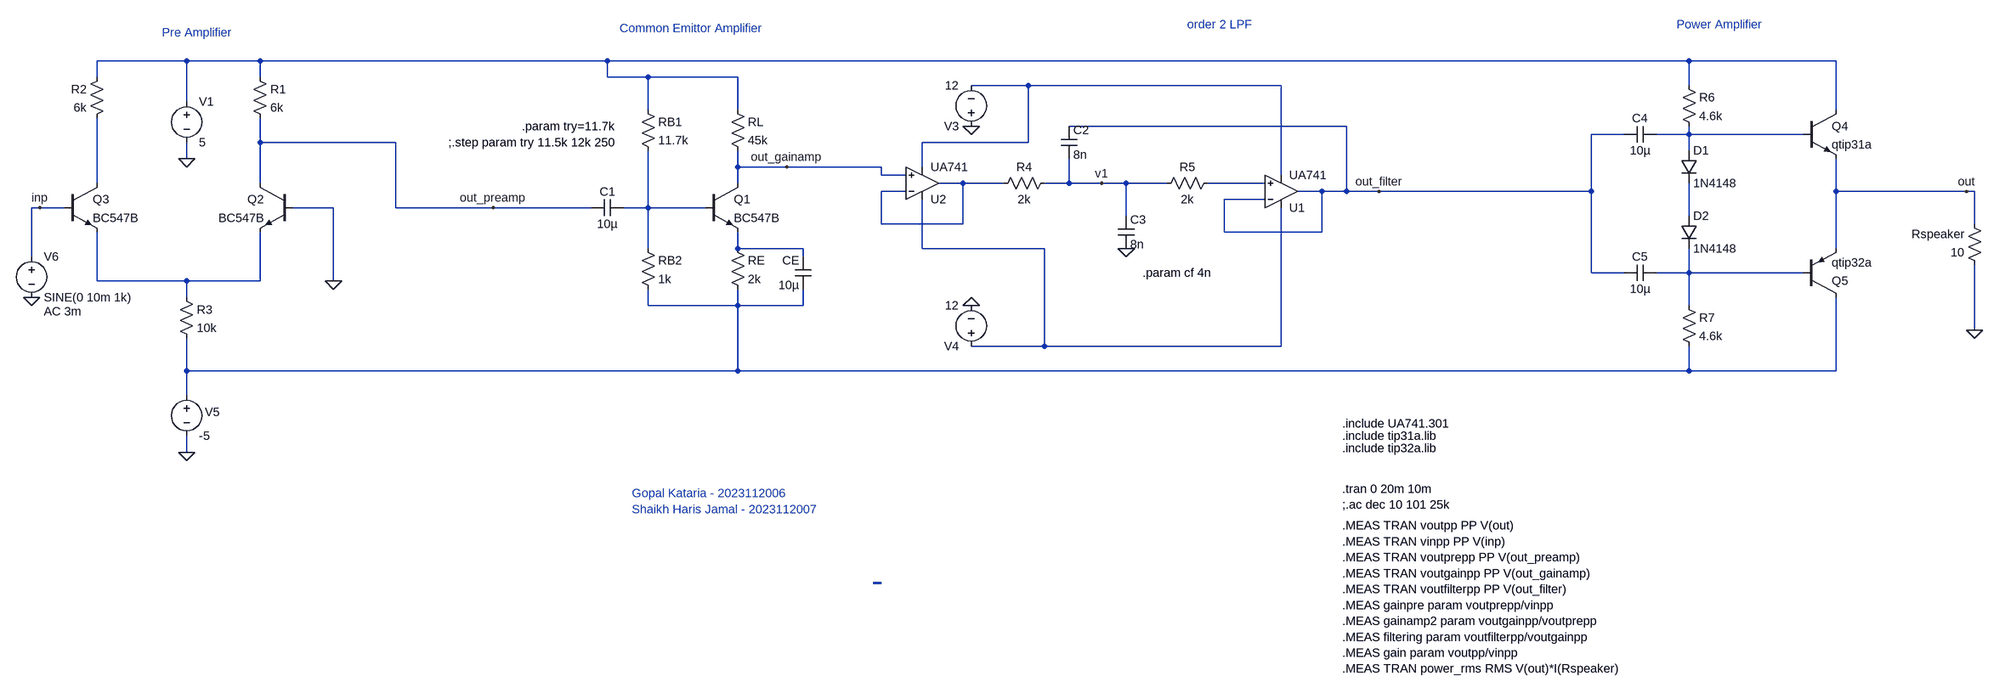
[diagram p0: schematic amplifier.asc]
amplifier.asc, the LTspice schematic file:
Version 4
SHEET 1 3276 1088
WIRE -1024 -176 -1200 -176
WIRE -880 -176 -1024 -176
WIRE -32 -176 -880 -176
WIRE 2288 -176 -32 -176
WIRE 2576 -176 2288 -176
WIRE -1200 -144 -1200 -176
WIRE -880 -144 -880 -176
WIRE -32 -144 -32 -176
WIRE 48 -144 -32 -144
WIRE 224 -144 48 -144
WIRE 992 -128 880 -128
WIRE 1488 -128 992 -128
WIRE 2288 -128 2288 -176
WIRE -1024 -96 -1024 -176
WIRE 48 -80 48 -144
WIRE 224 -80 224 -144
WIRE 2576 -80 2576 -176
WIRE 1616 -48 1072 -48
WIRE 2160 -32 2096 -32
WIRE 2288 -32 2288 -48
WIRE 2288 -32 2224 -32
WIRE 2512 -32 2288 -32
WIRE -880 -16 -880 -64
WIRE -464 -16 -880 -16
WIRE 992 -16 992 -128
WIRE 992 -16 784 -16
WIRE 2288 0 2288 -32
WIRE -1024 16 -1024 -16
WIRE 224 32 224 0
WIRE 320 32 224 32
WIRE 704 32 320 32
WIRE 784 32 784 -16
WIRE 704 48 704 32
WIRE 752 48 704 48
WIRE 1488 48 1488 -128
WIRE -1200 64 -1200 -64
WIRE -880 64 -880 -16
WIRE 224 64 224 32
WIRE 864 64 816 64
WIRE 944 64 864 64
WIRE 1072 64 1072 16
WIRE 1072 64 1024 64
WIRE 1136 64 1072 64
WIRE 1184 64 1136 64
WIRE 1264 64 1184 64
WIRE 1456 64 1344 64
WIRE 752 80 704 80
WIRE 1568 80 1520 80
WIRE 1616 80 1616 -48
WIRE 1616 80 1568 80
WIRE 1680 80 1616 80
WIRE 2064 80 1680 80
WIRE 2096 80 2096 -32
WIRE 2096 80 2064 80
WIRE 2576 80 2576 16
WIRE 2832 80 2576 80
WIRE 2848 80 2832 80
WIRE 1456 96 1376 96
WIRE -1312 112 -1328 112
WIRE -1264 112 -1312 112
WIRE -768 112 -816 112
WIRE -736 112 -768 112
WIRE -464 112 -464 -16
WIRE -256 112 -464 112
WIRE -64 112 -256 112
WIRE 48 112 48 0
WIRE 48 112 0 112
WIRE 160 112 48 112
WIRE 1184 128 1184 64
WIRE 2288 128 2288 64
WIRE 704 144 704 80
WIRE 864 144 864 64
WIRE 864 144 704 144
WIRE 2848 144 2848 80
WIRE 1376 160 1376 96
WIRE 1568 160 1568 80
WIRE 1568 160 1376 160
WIRE 48 192 48 112
WIRE 224 192 224 160
WIRE 352 192 224 192
WIRE 784 192 784 96
WIRE 1024 192 784 192
WIRE 2576 192 2576 80
WIRE -1328 208 -1328 112
WIRE 352 208 352 192
WIRE 2096 240 2096 80
WIRE 2160 240 2096 240
WIRE 2288 240 2288 192
WIRE 2288 240 2224 240
WIRE 2512 240 2288 240
WIRE -1200 256 -1200 160
WIRE -1024 256 -1200 256
WIRE -880 256 -880 160
WIRE -880 256 -1024 256
WIRE -736 256 -736 112
WIRE -1024 288 -1024 256
WIRE 48 304 48 272
WIRE 224 304 224 272
WIRE 224 304 48 304
WIRE 352 304 352 272
WIRE 352 304 224 304
WIRE 2288 304 2288 240
WIRE 2848 352 2848 224
WIRE 1024 384 1024 192
WIRE 1024 384 880 384
WIRE 1488 384 1488 112
WIRE 1488 384 1024 384
WIRE -1024 432 -1024 368
WIRE 224 432 224 304
WIRE 224 432 -1024 432
WIRE 2288 432 2288 384
WIRE 2288 432 224 432
WIRE 2576 432 2576 288
WIRE 2576 432 2288 432
WIRE -1024 480 -1024 432
WIRE -1024 592 -1024 560
FLAG -1024 16 0
FLAG -736 256 0
FLAG -1024 592 0
FLAG 1136 64 v1
FLAG 1184 192 0
FLAG 880 -48 0
FLAG 880 304 0
FLAG -1328 288 0
FLAG 2848 352 0
FLAG -1312 112 inp
FLAG -256 112 out_preamp
FLAG 320 32 out_gainamp
FLAG 1680 80 out_filter
FLAG 2832 80 out
DATAFLAG -768 112 ""
DATAFLAG 2064 80 ""
BUSTAP 688 848 704 848
SYMBOL npn 160 64 R0
SYMATTR InstName Q1
SYMATTR Value BC547B
SYMBOL cap 0 96 R90
WINDOW 0 0 32 VBottom 2
WINDOW 3 32 32 VTop 2
SYMATTR InstName C1
SYMATTR Value 10µ
SYMBOL res 32 -96 R0
SYMATTR InstName RB1
SYMATTR Value 11.7k
SYMBOL res 32 176 R0
SYMATTR InstName RB2
SYMATTR Value 1k
SYMBOL res 208 -96 R0
SYMATTR InstName RL
SYMATTR Value 45k
SYMBOL res 208 176 R0
SYMATTR InstName RE
SYMATTR Value 2k
SYMBOL cap 368 272 R180
WINDOW 0 24 56 Left 2
WINDOW 3 24 8 Left 2
SYMATTR InstName CE
SYMATTR Value 10µ
SYMBOL npn -816 64 M0
SYMATTR InstName Q2
SYMATTR Value BC547B
SYMBOL voltage -1024 -112 R0
WINDOW 123 0 0 Left 2
WINDOW 39 0 0 Left 2
SYMATTR InstName V1
SYMATTR Value 5
SYMBOL res -896 -160 R0
SYMATTR InstName R1
SYMATTR Value 6k
SYMBOL npn -1264 64 R0
SYMATTR InstName Q3
SYMATTR Value BC547B
SYMBOL res -1184 -160 M0
SYMATTR InstName R2
SYMATTR Value 6k
SYMBOL res -1040 272 R0
SYMATTR InstName R3
SYMATTR Value 10k
SYMBOL voltage -1024 464 R0
WINDOW 123 0 0 Left 2
WINDOW 39 0 0 Left 2
WINDOW 0 36 49 Left 2
SYMATTR InstName V5
SYMATTR Value -5
SYMBOL OpAmps\\opamp2 1488 144 M180
SYMATTR InstName U1
SYMATTR Value UA741
SYMBOL voltage 880 -32 R180
WINDOW 123 0 0 Left 2
WINDOW 39 0 0 Left 2
SYMATTR InstName V3
SYMATTR Value 12
SYMBOL voltage 880 400 R180
WINDOW 123 0 0 Left 2
WINDOW 39 0 0 Left 2
SYMATTR InstName V4
SYMATTR Value 12
SYMBOL res 1040 48 R90
WINDOW 0 0 56 VBottom 2
WINDOW 3 32 56 VTop 2
SYMATTR InstName R4
SYMATTR Value 2k
SYMBOL res 1360 48 R90
WINDOW 0 0 56 VBottom 2
WINDOW 3 32 56 VTop 2
SYMATTR InstName R5
SYMATTR Value 2k
SYMBOL cap 1056 -48 R0
SYMATTR InstName C2
SYMATTR Value 8n
SYMBOL cap 1168 128 R0
SYMATTR InstName C3
SYMATTR Value 8n
SYMBOL voltage -1328 192 R0
WINDOW 123 24 124 Left 2
WINDOW 39 0 0 Left 2
SYMATTR Value2 AC 3m
SYMATTR InstName V6
SYMATTR Value SINE(0 10m 1k)
SYMBOL OpAmps\\opamp2 784 128 M180
SYMATTR InstName U2
SYMATTR Value UA741
SYMBOL cap 2224 -48 R90
WINDOW 0 0 32 VBottom 2
WINDOW 3 32 32 VTop 2
SYMATTR InstName C4
SYMATTR Value 10µ
SYMBOL cap 2224 224 R90
WINDOW 0 0 32 VBottom 2
WINDOW 3 32 32 VTop 2
SYMATTR InstName C5
SYMATTR Value 10µ
SYMBOL res 2272 -144 R0
SYMATTR InstName R6
SYMATTR Value 4.6k
SYMBOL res 2272 288 R0
SYMATTR InstName R7
SYMATTR Value 4.6k
SYMBOL npn 2512 -80 R0
SYMATTR InstName Q4
SYMATTR Value qtip31a
SYMBOL pnp 2512 288 M180
SYMATTR InstName Q5
SYMATTR Value qtip32a
SYMBOL diode 2272 0 R0
SYMATTR InstName D1
SYMATTR Value 1N4148
SYMBOL diode 2272 128 R0
SYMATTR InstName D2
SYMATTR Value 1N4148
SYMBOL res 2864 240 R180
WINDOW 0 36 76 Left 2
WINDOW 3 36 40 Left 2
SYMATTR InstName Rspeaker
SYMATTR Value 10
TEXT 1608 664 Left 2 !.tran 0 20m 10m\n;.ac dec 10 101 25k
TEXT -8 -240 Left 2 ;Common Emittor Amplifier
TEXT -200 -48 Left 2 !.param try=11.7k
TEXT 1608 536 Left 2 !.include UA741.301
TEXT 1216 240 Left 2 !.param cf 4n
TEXT -344 -16 Left 2 !;.step param try 11.5k 12k 250
TEXT 1608 560 Left 2 !.include tip31a.lib
TEXT 1608 584 Left 2 !.include tip32a.lib
TEXT -1072 -232 Left 2 ;Pre Amplifier
TEXT 1304 -248 Left 2 ;order 2 LPF
TEXT 2264 -248 Left 2 ;Power Amplifier
TEXT 1608 736 Left 2 !.MEAS TRAN voutpp PP V(out)\n.MEAS TRAN vinpp PP V(inp)\n.MEAS TRAN voutprepp PP V(out_preamp)\n.MEAS TRAN voutgainpp PP V(out_gainamp)\n.MEAS TRAN voutfilterpp PP V(out_filter)\n.MEAS gainpre param voutprepp/vinpp\n.MEAS gainamp2 param voutgainpp/voutprepp\n.MEAS filtering param voutfilterpp/voutgainpp\n.MEAS gain param voutpp/vinpp\n.MEAS TRAN power_rms RMS V(out)*I(Rspeaker)
TEXT 16 672 Left 2 ;Gopal Kataria - 2023112006
TEXT 16 704 Left 2 ;Shaikh Haris Jamal - 2023112007

The netlist it stands for:
* amplifier.asc
Q1 out_gainamp N007 N009 0 BC547B
C1 N007 out_preamp 10µ
RB1 N001 N007 11.7k
RB2 N007 N013 1k
RL N001 out_gainamp 45k
RE N009 N013 2k
CE N013 N009 10µ
Q2 out_preamp 0 N012 0 BC547B
V1 N001 0 5
R1 N001 out_preamp 6k
Q3 N004 inp N012 0 BC547B
R2 N001 N004 6k
R3 N012 N013 10k
V5 N013 0 -5
XU1 N006 out_filter N010 N002 out_filter UA741  ; pins In+ In- V+ V- OUT
V3 0 N002 12
V4 N010 0 12
R4 v1 N005 2k
R5 N006 v1 2k
C2 out_filter v1 8n
C3 v1 0 8n
V6 inp 0 SINE(0 10m 1k) AC 3m
XU2 out_gainamp N005 N010 N002 N005 UA741  ; pins In+ In- V+ V- OUT
C4 N003 out_filter 10µ
C5 N011 out_filter 10µ
R6 N001 N003 4.6k
R7 N011 N013 4.6k
Q4 N001 N003 out 0 qtip31a
Q5 N013 N011 out 0 qtip32a
D1 N003 N008 1N4148
D2 N008 N011 1N4148
Rspeaker 0 out 10
.model D D
.lib standard.dio
.model NPN NPN
.model PNP PNP
.lib standard.bjt
.tran 0 20m 10m
;.ac dec 10 101 25k
* Common Emittor Amplifier
.param try=11.7k
.include UA741.301
.param cf 4n
;.step param try 11.5k 12k 250
.include tip31a.lib
.include tip32a.lib
* Pre Amplifier
* order 2 LPF
* Power Amplifier
.MEAS TRAN voutpp PP V(out)
.MEAS TRAN vinpp PP V(inp)
.MEAS TRAN voutprepp PP V(out_preamp)
.MEAS TRAN voutgainpp PP V(out_gainamp)
.MEAS TRAN voutfilterpp PP V(out_filter)
.MEAS gainpre param voutprepp/vinpp
.MEAS gainamp2 param voutgainpp/voutprepp
.MEAS filtering param voutfilterpp/voutgainpp
.MEAS gain param voutpp/vinpp
.MEAS TRAN power_rms RMS V(out)*I(Rspeaker)
* Gopal Kataria - 2023112006
* Shaikh Haris Jamal - 2023112007
.backanno
.end